# Altium schematic sheet POWER.SchDoc
size A4; SheetNumber: 2; SheetTotal: 6
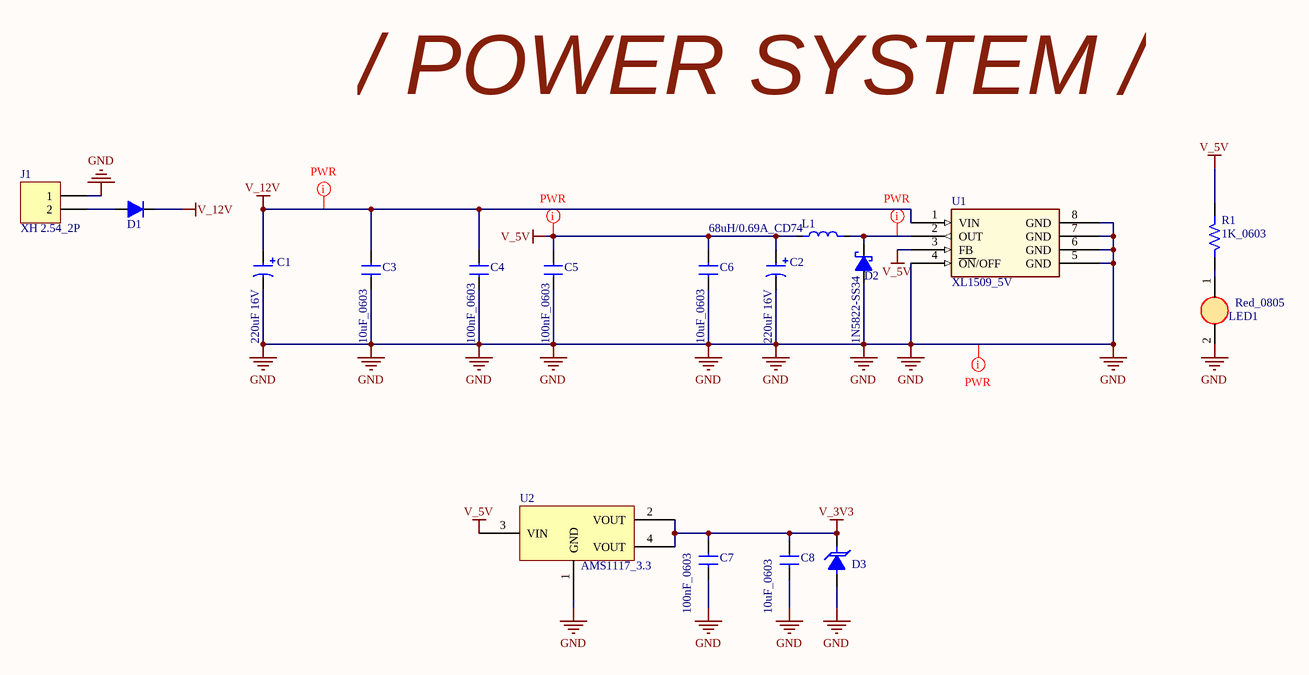
[diagram p0: POWER.SchDoc]

## Parts
C1  220uF 16V  [CAP-ALU-SMD-6.3x7.7]
C2  220uF 16V  [CAP-ALU-SMD-6.3x7.7]
C3  10uF_0603  [CN-SMD-0603]
C4  100nF_0603  [CN-SMD-0603]
C5  100nF_0603  [CN-SMD-0603]
C6  10uF_0603  [CN-SMD-0603]
C7  100nF_0603  [CN-SMD-0603]
C8  10uF_0603  [CN-SMD-0603]
D1  1N5408-S3M  [SMA]  (value not drawn)
D2  1N5822-SS34  [SMA]
D3  SMBJ5.0A_KE  [SMB]  (value not drawn)
J1  XH 2.54_2P  [Header2]
L1  68uH/0.69A_CD74  [INDUCTOR_CD74]
LED1  Red_0805  [LED-0805-Red]
R1  1K_0603  [RES-SMD-0603]
U1  XL1509_5V  [SO8]
U2  AMS1117_3.3  [SOT223-4N]

## Nets
GND: C1.2 C2.2 C3.1 C4.1 C5.1 C6.1 C7.1 C8.1 D2.1(A) D3.1(A) J1.1 LED1.2(K) U1.4(~{ON}/OFF) U1.5(GND) U1.6(GND) U1.7(GND) U1.8(GND) U2.1(GND)
V_3V3: C7.2 C8.2 D3.2(K) U2.2(VOUT) U2.4(VOUT)
V_5V: C2.1 C5.2 C6.2 L1.1 R1.2 U1.3(FB) U2.3(VIN)
V_12V: C1.1 C3.2 C4.2 D1.2(K) U1.1(VIN)
NetD1_1: D1.1(A) J1.2
NetD2_2: D2.2(K) L1.2 U1.2(OUT)
NetLED1_1: LED1.1(A) R1.1

## Layout directives
net class PWR: GND, NetD2_2, V_5V, V_12V

## Notes on the sheet
- / POWER SYSTEM /

## Library data of the parts
C1 C2 = CAP ALU 220uF 16V: 6.3 x 7, CAP ALU; Description 1: 10 => 220uF/6,3V/10V - 10uF => 100uF/16V; Description 2: 0,1uF => 33uF/50V - 10uF => 22uF/63V; Description 3: 0,47uF => 10uF/100V
C3 C6 C8 = CAP 0603 106: Cap SMD, 0.06x0.03 inch, 1.55x0.85 mm - 1608
C4 C5 C7 = CAP 0603 104: Cap SMD, 0.06x0.03 inch, 1.55x0.85 mm - 1608
D1 = Diode 1N5408 S3M: Power Diode 3A, VRRM ~ 1000V; Code - JEDEC: DO-214-AB; Value: 1N5007; Published: 8-Jun-2000; Revision: July-2002: Re-released for DXP Platform.; Publisher: Altium Limited
D2 = Diode 1N5822 SS34: Schottky diode, 3A, VRRM 40V; Code - JEDEC: DO-214-AB; Value: 1N5007; Published: 8-Jun-2000; Revision: July-2002: Re-released for DXP Platform.; Publisher: Altium Limited
D3 = Diode SMBJ5.0A: TVS Diode, Vrrm =5.0V, Vcl = 9.2V; Code - JEDEC: DO-214-AB; Value: 1N5007; Published: 8-Jun-2000; Revision: July-2002: Re-released for DXP Platform.; Publisher: Altium Limited
L1 = CD74 680: SMD Power Inductor SMD Power Inductor / CDRH74
LED1 = LED 0805 RED: LED SMD
R1 = RES 0603 1K: Resistor SMD, 0.06x0.03 inch, 1.55x0.85 mm - 1608, 1/10W
U2 = AMS1117_SOT223_3V3: AMS1117_SOT223_3V3, 1.4A, Vin = 18V